# Altium schematic sheet LDO-3V3.SchDoc
size A4
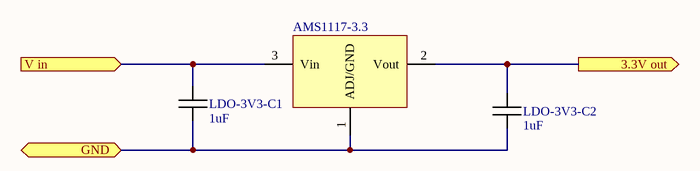
[diagram p0: LDO-3V3.SchDoc]

## Parts
AMS1117-3.3  AMS1117  [SOT-223-3]  (value not drawn)
LDO-3V3-C1  1uF  [C 0805 / 2012]
LDO-3V3-C2  1uF  [C 0805 / 2012]

## Ports
3.3V out (out), GND, V in (in)

## Nets
3.3V out: AMS1117-3.3.2(Vout) LDO-3V3-C2.2 ; port 3.3V out
GND: AMS1117-3.3.1(ADJ/GND) LDO-3V3-C1.1 LDO-3V3-C2.1 ; port GND
V in: AMS1117-3.3.3(Vin) LDO-3V3-C1.2 ; port V in

## Library data of the parts
AMS1117-3.3 = AMS1117: LDO 3.3V/5V/12V
LDO-3V3-C1 LDO-3V3-C2 = Capacitor